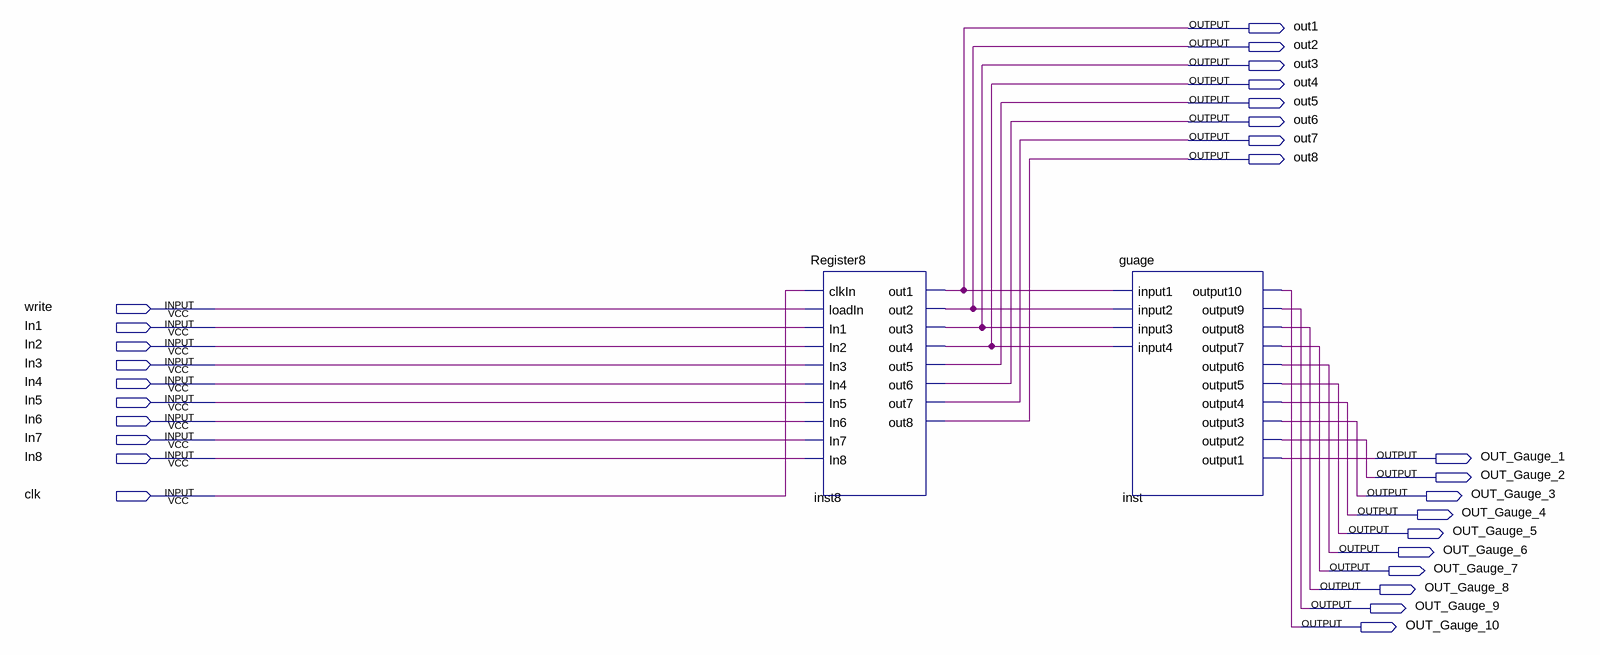
[diagram p0: schematic sheet]
// Quartus schematic OUTPUT_gauge.bdf as structural Verilog: 2 symbols, 28 pins
module OUTPUT_gauge (
  input  write,
  input  In1,
  input  In2,
  input  In3,
  input  In4,
  input  In5,
  input  In6,
  input  In7,
  input  In8,
  input  clk,
  output out1,
  output out2,
  output out3,
  output out4,
  output out5,
  output out6,
  output out7,
  output out8,
  output OUT_Gauge_1,
  output OUT_Gauge_2,
  output OUT_Gauge_3,
  output OUT_Gauge_4,
  output OUT_Gauge_5,
  output OUT_Gauge_6,
  output OUT_Gauge_7,
  output OUT_Gauge_8,
  output OUT_Gauge_9,
  output OUT_Gauge_10
);

  Register8 inst8 (
    .clkIn(clk), .loadIn(write), .In1(In1), .In2(In2), .In3(In3), .In4(In4), .In5(In5), .In6(In6), .In7(In7),
    .In8(In8), .out1(out1), .out2(out2), .out3(out3), .out4(out4), .out5(out5), .out6(out6), .out7(out7),
    .out8(out8));
  guage inst (
    .input1(out1), .input2(out2), .input3(out3), .input4(out4), .output10(OUT_Gauge_10),
    .output9(OUT_Gauge_9), .output8(OUT_Gauge_8), .output7(OUT_Gauge_7), .output6(OUT_Gauge_6),
    .output5(OUT_Gauge_5), .output4(OUT_Gauge_4), .output3(OUT_Gauge_3), .output2(OUT_Gauge_2),
    .output1(OUT_Gauge_1));
endmodule
